# Altium schematic sheet 4-20.SchDoc
size A3
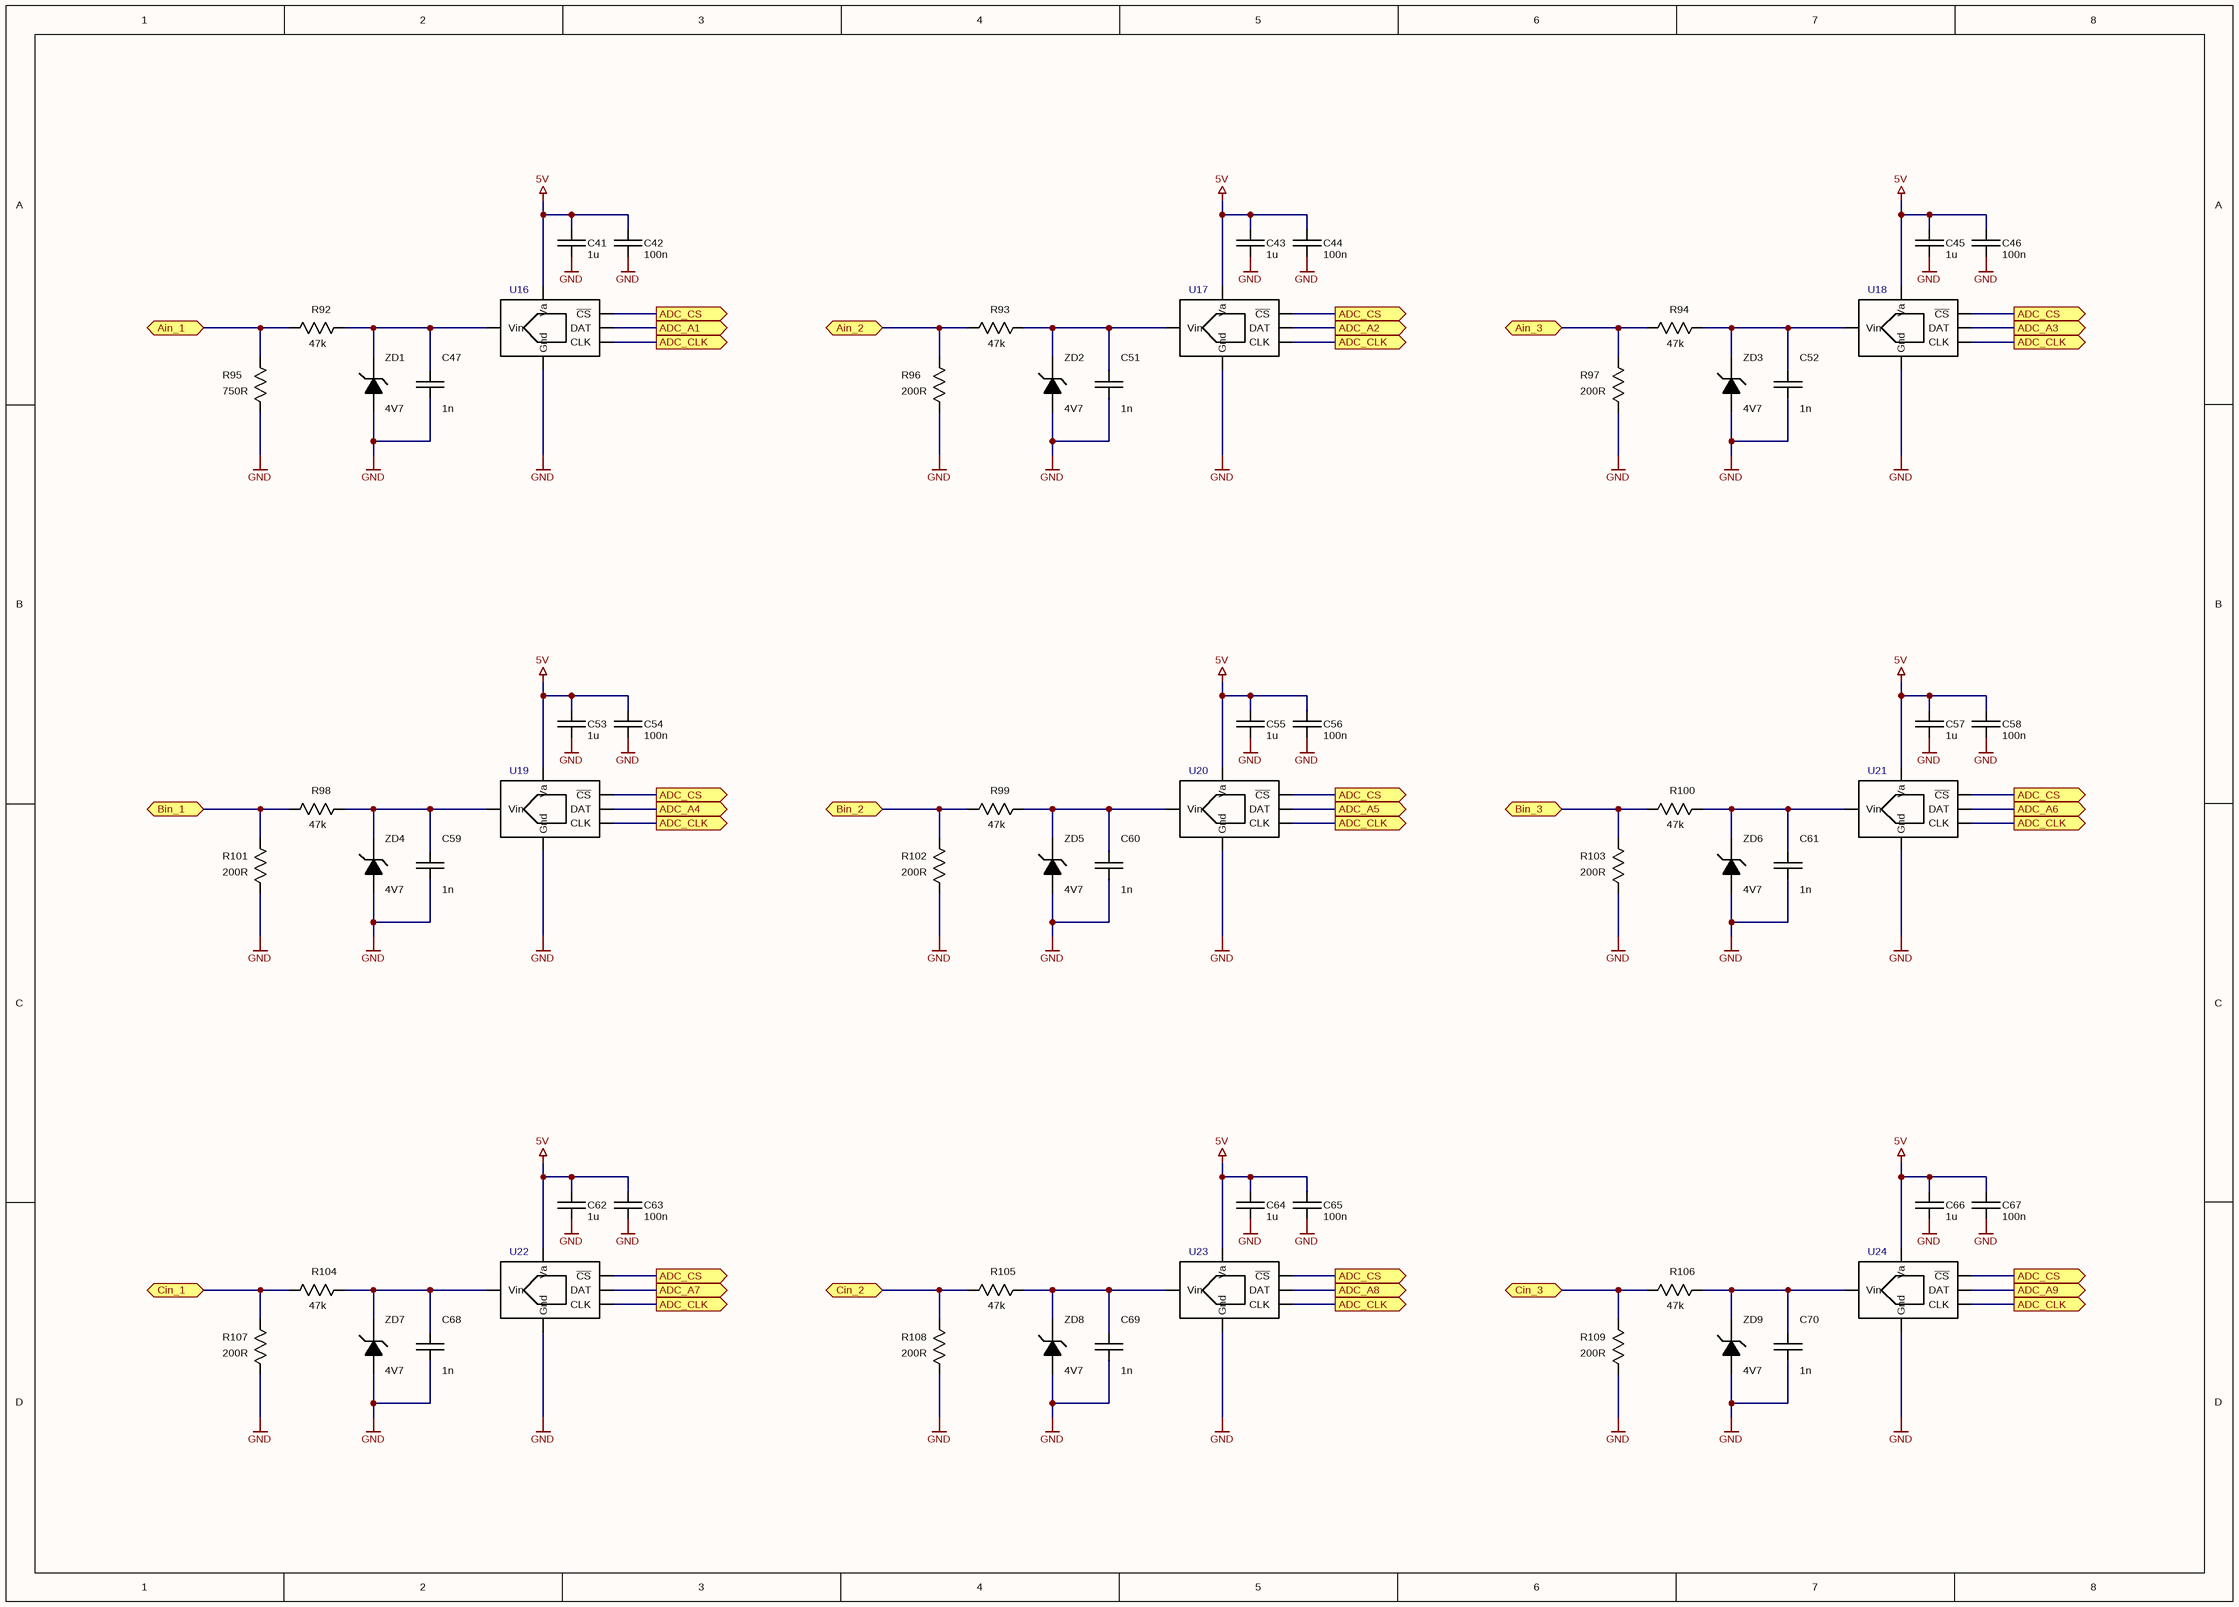
[diagram p0: 4-20.SchDoc]

## Parts
C41  1u  [CAP CER 0603 NP]
C42  100n  [CAP CER 0603 NP]
C43  1u  [CAP CER 0603 NP]
C44  100n  [CAP CER 0603 NP]
C45  1u  [CAP CER 0603 NP]
C46  100n  [CAP CER 0603 NP]
C47  1n  [CAP CER 0603 NP]
C51  1n  [CAP CER 0603 NP]
C52  1n  [CAP CER 0603 NP]
C53  1u  [CAP CER 0603 NP]
C54  100n  [CAP CER 0603 NP]
C55  1u  [CAP CER 0603 NP]
C56  100n  [CAP CER 0603 NP]
C57  1u  [CAP CER 0603 NP]
C58  100n  [CAP CER 0603 NP]
C59  1n  [CAP CER 0603 NP]
C60  1n  [CAP CER 0603 NP]
C61  1n  [CAP CER 0603 NP]
C62  1u  [CAP CER 0603 NP]
C63  100n  [CAP CER 0603 NP]
C64  1u  [CAP CER 0603 NP]
C65  100n  [CAP CER 0603 NP]
C66  1u  [CAP CER 0603 NP]
C67  100n  [CAP CER 0603 NP]
C68  1n  [CAP CER 0603 NP]
C69  1n  [CAP CER 0603 NP]
C70  1n  [CAP CER 0603 NP]
R92  47k  [RES 0603]
R93  47k  [RES 0603]
R94  47k  [RES 0603]
R95  750R  [RES 1210]
R96  200R  [RES 1210]
R97  200R  [RES 1210]
R98  47k  [RES 0603]
R99  47k  [RES 0603]
R100  47k  [RES 0603]
R101  200R  [RES 1210]
R102  200R  [RES 1210]
R103  200R  [RES 1210]
R104  47k  [RES 0603]
R105  47k  [RES 0603]
R106  47k  [RES 0603]
R107  200R  [RES 1210]
R108  200R  [RES 1210]
R109  200R  [RES 1210]
U16  SAR ADC  [SOT-23-6]  (value not drawn)
U17  SAR ADC  [SOT-23-6]  (value not drawn)
U18  SAR ADC  [SOT-23-6]  (value not drawn)
U19  SAR ADC  [SOT-23-6]  (value not drawn)
U20  SAR ADC  [SOT-23-6]  (value not drawn)
U21  SAR ADC  [SOT-23-6]  (value not drawn)
U22  SAR ADC  [SOT-23-6]  (value not drawn)
U23  SAR ADC  [SOT-23-6]  (value not drawn)
U24  SAR ADC  [SOT-23-6]  (value not drawn)
ZD1  4V7  [SOD323 (SC-76) - Reflow]
ZD2  4V7  [SOD323 (SC-76) - Reflow]
ZD3  4V7  [SOD323 (SC-76) - Reflow]
ZD4  4V7  [SOD323 (SC-76) - Reflow]
ZD5  4V7  [SOD323 (SC-76) - Reflow]
ZD6  4V7  [SOD323 (SC-76) - Reflow]
ZD7  4V7  [SOD323 (SC-76) - Reflow]
ZD8  4V7  [SOD323 (SC-76) - Reflow]
ZD9  4V7  [SOD323 (SC-76) - Reflow]

## Ports
ADC_A1, ADC_A2, ADC_A3, ADC_A4, ADC_A5, ADC_A6, ADC_A7, ADC_A8, ADC_A9, ADC_CLK, ADC_CS, Ain_1, Ain_2, Ain_3, Bin_1, Bin_2, Bin_3, Cin_1, Cin_2, Cin_3

## Nets
5V: C41.1 C42.2 C43.1 C44.2 C45.1 C46.2 C53.1 C54.2 C55.1 C56.2 C57.1 C58.2 C62.1 C63.2 C64.1 C65.2 C66.1 C67.2 U16.1(Va) U17.1(Va) U18.1(Va) U19.1(Va) U20.1(Va) U21.1(Va) U22.1(Va) U23.1(Va) U24.1(Va)
GND: C41.2 C42.1 C43.2 C44.1 C45.2 C46.1 C47.1 C51.1 C52.1 C53.2 C54.1 C55.2 C56.1 C57.2 C58.1 C59.1 C60.1 C61.1 C62.2 C63.1 C64.2 C65.1 C66.2 C67.1 C68.1 C69.1 C70.1 R95.1 R96.1 R97.1 R101.1 R102.1 R103.1 R107.1 R108.1 R109.1 U16.2(Gnd) U17.2(Gnd) U18.2(Gnd) U19.2(Gnd) U20.2(Gnd) U21.2(Gnd) U22.2(Gnd) U23.2(Gnd) U24.2(Gnd) ZD1.1(A) ZD2.1(A) ZD3.1(A) ZD4.1(A) ZD5.1(A) ZD6.1(A) ZD7.1(A) ZD8.1(A) ZD9.1(A)
ADC_A1: U16.5(DAT) ; port ADC_A1
ADC_A2: U17.5(DAT) ; port ADC_A2
ADC_A3: U18.5(DAT) ; port ADC_A3
ADC_A4: U19.5(DAT) ; port ADC_A4
ADC_A5: U20.5(DAT) ; port ADC_A5
ADC_A6: U21.5(DAT) ; port ADC_A6
ADC_A7: U22.5(DAT) ; port ADC_A7
ADC_A8: U23.5(DAT) ; port ADC_A8
ADC_A9: U24.5(DAT) ; port ADC_A9
ADC_CLK: U16.4(CLK) U17.4(CLK) U18.4(CLK) U19.4(CLK) U20.4(CLK) U21.4(CLK) U22.4(CLK) U23.4(CLK) U24.4(CLK) ; port ADC_CLK
ADC_CS: U16.6(~{CS}) U17.6(~{CS}) U18.6(~{CS}) U19.6(~{CS}) U20.6(~{CS}) U21.6(~{CS}) U22.6(~{CS}) U23.6(~{CS}) U24.6(~{CS}) ; port ADC_CS
Ain_1: R92.2 R95.2 ; port Ain_1
Ain_2: R93.2 R96.2 ; port Ain_2
Ain_3: R94.2 R97.2 ; port Ain_3
Bin_1: R98.2 R101.2 ; port Bin_1
Bin_2: R99.2 R102.2 ; port Bin_2
Bin_3: R100.2 R103.2 ; port Bin_3
Cin_1: R104.2 R107.2 ; port Cin_1
Cin_2: R105.2 R108.2 ; port Cin_2
Cin_3: R106.2 R109.2 ; port Cin_3
NetC47_2: C47.2 R92.1 U16.3(Vin) ZD1.2(C)
NetC51_2: C51.2 R93.1 U17.3(Vin) ZD2.2(C)
NetC52_2: C52.2 R94.1 U18.3(Vin) ZD3.2(C)
NetC59_2: C59.2 R98.1 U19.3(Vin) ZD4.2(C)
NetC60_2: C60.2 R99.1 U20.3(Vin) ZD5.2(C)
NetC61_2: C61.2 R100.1 U21.3(Vin) ZD6.2(C)
NetC68_2: C68.2 R104.1 U22.3(Vin) ZD7.2(C)
NetC69_2: C69.2 R105.1 U23.3(Vin) ZD8.2(C)
NetC70_2: C70.2 R106.1 U24.3(Vin) ZD9.2(C)

## Library data of the parts
C41 C43 C45 C53 C55 C57 C62 C64 C66 = Capacitor: CC0603KRX5R7BB105
C42 C44 C46 C54 C56 C58 C63 C65 C67 = Capacitor: CC0603KRX7R9BB104
C47 C51 C52 C59-C61 C68-C70 = Capacitor: CC0603KRX7R0BB102
R92-R94 R98-R100 R104-R106 = Resistor: RC0603FR-0747KL
R95 = Resistor: RC1206FR-07750RL
R96 R97 R101-R103 R107-R109 = Resistor: RC1210FR-07200RL
U16-U24 = ADC121: ADC121S021CIMF
ZD1-ZD9 = Diode Zenner: BZX384-C4V7; pin to pad: 1>2 2>1